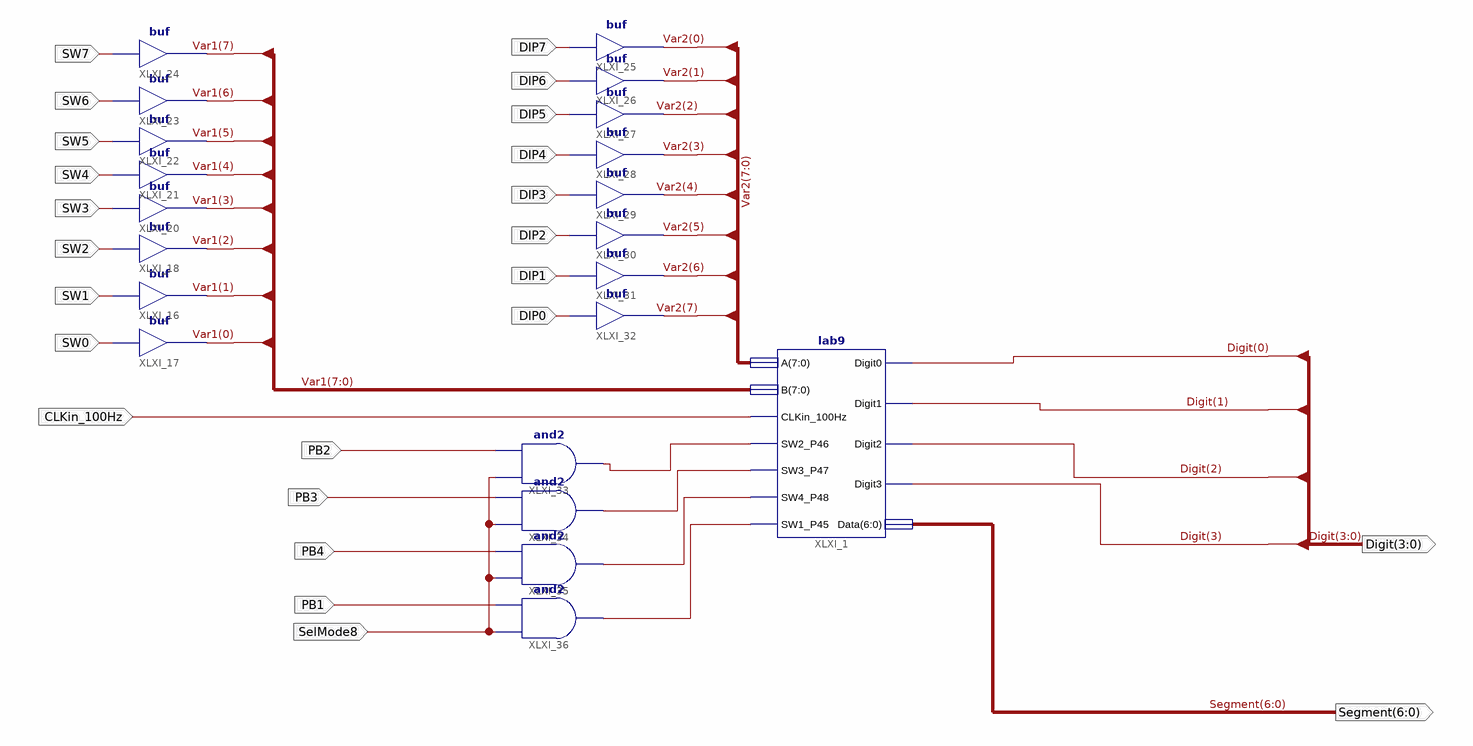
[diagram p0: schematic sheet 1]
// Xilinx ISE schematic moduleLab08_09.sch (spartan6) as structural Verilog: 21 symbols, 24 ports
module moduleLab08_09 (
  input  CLKin_100Hz,
  input  SW2,
  input  SW3,
  input  SW4,
  input  SW1,
  input  SW7,
  input  SW6,
  input  SW5,
  input  SW0,
  input  DIP7,
  input  DIP6,
  input  DIP5,
  input  DIP4,
  input  DIP3,
  input  DIP2,
  input  DIP1,
  input  DIP0,
  input  PB1,
  input  PB3,
  input  SelMode8,
  input  PB4,
  input  PB2,
  output [3:0] Digit,
  output [6:0] Segment
);

  wire XLXN_13, XLXN_14, XLXN_23, XLXN_24;
  wire [7:0] Var1, Var2;

  lab9 XLXI_1 (
    .A(Var2), .B(Var1), .CLKin_100Hz(CLKin_100Hz), .SW2_P46(XLXN_24), .SW3_P47(XLXN_13), .SW4_P48(XLXN_14),
    .SW1_P45(XLXN_23), .Digit0(Digit[0]), .Digit1(Digit[1]), .Digit2(Digit[2]), .Digit3(Digit[3]),
    .Data(Segment));
  buf XLXI_25 (Var2[0], DIP7);
  buf XLXI_26 (Var2[1], DIP6);
  buf XLXI_27 (Var2[2], DIP5);
  buf XLXI_28 (Var2[3], DIP4);
  buf XLXI_29 (Var2[4], DIP3);
  buf XLXI_30 (Var2[5], DIP2);
  buf XLXI_31 (Var2[6], DIP1);
  buf XLXI_32 (Var2[7], DIP0);
  buf XLXI_16 (Var1[1], SW1);
  buf XLXI_17 (Var1[0], SW0);
  buf XLXI_18 (Var1[2], SW2);
  buf XLXI_20 (Var1[3], SW3);
  buf XLXI_21 (Var1[4], SW4);
  buf XLXI_22 (Var1[5], SW5);
  buf XLXI_23 (Var1[6], SW6);
  buf XLXI_24 (Var1[7], SW7);
  and XLXI_33 (XLXN_24, SelMode8, PB2);
  and XLXI_34 (XLXN_13, SelMode8, PB3);
  and XLXI_35 (XLXN_14, SelMode8, PB4);
  and XLXI_36 (XLXN_23, SelMode8, PB1);
endmodule
